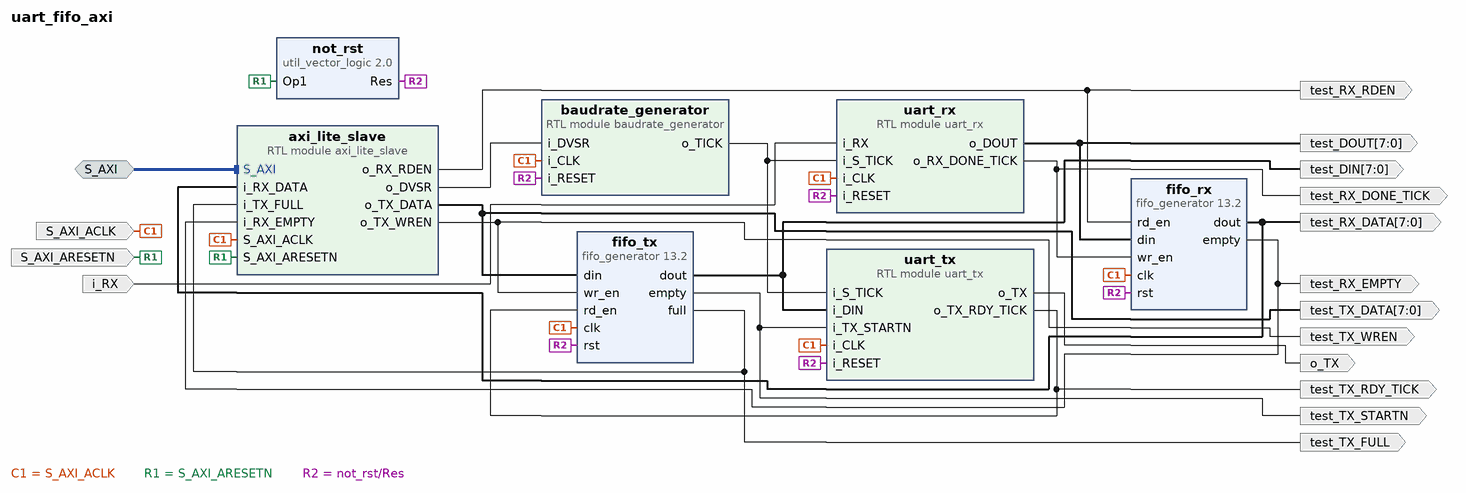
[diagram p0: block diagram of the top level]
# Vivado block design uart_fifo_axi, xc7z020clg400-1, Vivado 2023.2
create_bd_design uart_fifo_axi

create_bd_intf_port -mode Slave -vlnv xilinx.com:interface:aximm_rtl:1.0 S_AXI
set_property -dict [list \
  CONFIG.ADDR_WIDTH 16 \
  CONFIG.ARUSER_WIDTH 0 \
  CONFIG.AWUSER_WIDTH 0 \
  CONFIG.BUSER_WIDTH 0 \
  CONFIG.DATA_WIDTH 32 \
  CONFIG.HAS_BRESP 1 \
  CONFIG.HAS_BURST 0 \
  CONFIG.HAS_CACHE 0 \
  CONFIG.HAS_LOCK 0 \
  CONFIG.HAS_PROT 0 \
  CONFIG.HAS_QOS 0 \
  CONFIG.HAS_REGION 0 \
  CONFIG.HAS_RRESP 1 \
  CONFIG.HAS_WSTRB 1 \
  CONFIG.ID_WIDTH 0 \
  CONFIG.MAX_BURST_LENGTH 1 \
  CONFIG.NUM_READ_OUTSTANDING 1 \
  CONFIG.NUM_READ_THREADS 1 \
  CONFIG.NUM_WRITE_OUTSTANDING 1 \
  CONFIG.NUM_WRITE_THREADS 1 \
  CONFIG.PROTOCOL AXI4LITE \
  CONFIG.READ_WRITE_MODE READ_WRITE \
  CONFIG.RUSER_BITS_PER_BYTE 0 \
  CONFIG.RUSER_WIDTH 0 \
  CONFIG.SUPPORTS_NARROW_BURST 0 \
  CONFIG.WUSER_BITS_PER_BYTE 0 \
  CONFIG.WUSER_WIDTH 0 \
] [get_bd_intf_ports S_AXI]
create_bd_port -dir I i_RX
create_bd_port -dir O o_TX
create_bd_port -dir O -from 7 -to 0 test_DOUT
create_bd_port -dir O test_RX_DONE_TICK
create_bd_port -dir O -from 7 -to 0 test_DIN
create_bd_port -dir O test_TX_STARTN
create_bd_port -dir O test_TX_RDY_TICK
create_bd_port -dir I -type clk S_AXI_ACLK
set_property -dict {CONFIG.ASSOCIATED_BUSIF S_AXI} [get_bd_ports S_AXI_ACLK]
create_bd_port -dir I -type rst S_AXI_ARESETN
create_bd_port -dir O test_RX_EMPTY
create_bd_port -dir O -from 7 -to 0 test_RX_DATA
create_bd_port -dir O test_RX_RDEN
create_bd_port -dir O test_TX_FULL
create_bd_port -dir O -from 7 -to 0 test_TX_DATA
create_bd_port -dir O test_TX_WREN

create_bd_cell -type module -reference uart_tx uart_tx
create_bd_cell -type module -reference baudrate_generator baudrate_generator
create_bd_cell -type ip -vlnv xilinx.com:ip:fifo_generator:13.2 fifo_tx
set_property -dict {CONFIG.Fifo_Implementation Common_Clock_Builtin_FIFO CONFIG.Input_Data_Width 8} [get_bd_cells fifo_tx]
create_bd_cell -type module -reference uart_rx uart_rx
create_bd_cell -type ip -vlnv xilinx.com:ip:fifo_generator:13.2 fifo_rx
set_property -dict {CONFIG.Fifo_Implementation Common_Clock_Builtin_FIFO CONFIG.Input_Data_Width 8} [get_bd_cells fifo_rx]
create_bd_cell -type module -reference axi_lite_slave axi_lite_slave
create_bd_cell -type ip -vlnv xilinx.com:ip:util_vector_logic:2.0 not_rst
set_property -dict {CONFIG.C_OPERATION not CONFIG.C_SIZE 1} [get_bd_cells not_rst]

# ---- connections ----

connect_bd_intf_net -intf_net S_AXI_0_1 [get_bd_intf_ports S_AXI] [get_bd_intf_pins axi_lite_slave/S_AXI]
connect_bd_net -net S_AXI_ACLK_0_1 [get_bd_ports S_AXI_ACLK] \
  [get_bd_pins fifo_tx/clk] [get_bd_pins uart_rx/i_CLK] [get_bd_pins fifo_rx/clk] [get_bd_pins uart_tx/i_CLK] \
  [get_bd_pins axi_lite_slave/S_AXI_ACLK] [get_bd_pins baudrate_generator/i_CLK]
connect_bd_net -net S_AXI_ARESETN_1_1 [get_bd_ports S_AXI_ARESETN] [get_bd_pins not_rst/Op1] [get_bd_pins axi_lite_slave/S_AXI_ARESETN]
connect_bd_net -net axi_lite_slave_0_o_DVSR [get_bd_pins axi_lite_slave/o_DVSR] [get_bd_pins baudrate_generator/i_DVSR]
connect_bd_net [get_bd_pins axi_lite_slave/o_RX_RDEN] [get_bd_ports test_RX_RDEN] [get_bd_pins fifo_rx/rd_en]
connect_bd_net [get_bd_pins axi_lite_slave/o_TX_DATA] [get_bd_ports test_TX_DATA] [get_bd_pins fifo_tx/din]
connect_bd_net [get_bd_pins axi_lite_slave/o_TX_WREN] [get_bd_ports test_TX_WREN] [get_bd_pins fifo_tx/wr_en]
connect_bd_net -net baudrate_generator_0_o_TICK [get_bd_pins baudrate_generator/o_TICK] [get_bd_pins uart_rx/i_S_TICK] [get_bd_pins uart_tx/i_S_TICK]
connect_bd_net [get_bd_pins fifo_rx/dout] [get_bd_ports test_RX_DATA] [get_bd_pins axi_lite_slave/i_RX_DATA]
connect_bd_net [get_bd_pins fifo_rx/empty] [get_bd_ports test_RX_EMPTY] [get_bd_pins axi_lite_slave/i_RX_EMPTY]
connect_bd_net [get_bd_pins fifo_tx/dout] [get_bd_ports test_DIN] [get_bd_pins uart_tx/i_DIN]
connect_bd_net [get_bd_pins fifo_tx/empty] [get_bd_ports test_TX_STARTN] [get_bd_pins uart_tx/i_TX_STARTN]
connect_bd_net [get_bd_pins fifo_tx/full] [get_bd_ports test_TX_FULL] [get_bd_pins axi_lite_slave/i_TX_FULL]
connect_bd_net -net i_RX_0_1 [get_bd_ports i_RX] [get_bd_pins uart_rx/i_RX]
connect_bd_net [get_bd_pins uart_rx/o_DOUT] [get_bd_ports test_DOUT] [get_bd_pins fifo_rx/din]
connect_bd_net [get_bd_pins uart_rx/o_RX_DONE_TICK] [get_bd_ports test_RX_DONE_TICK] [get_bd_pins fifo_rx/wr_en]
connect_bd_net -net uart_tx_1_o_TX [get_bd_pins uart_tx/o_TX] [get_bd_ports o_TX]
connect_bd_net [get_bd_pins uart_tx/o_TX_RDY_TICK] [get_bd_ports test_TX_RDY_TICK] [get_bd_pins fifo_tx/rd_en]
connect_bd_net -net util_vector_logic_0_Res [get_bd_pins not_rst/Res] \
  [get_bd_pins fifo_rx/rst] [get_bd_pins fifo_tx/rst] [get_bd_pins uart_rx/i_RESET] [get_bd_pins uart_tx/i_RESET] \
  [get_bd_pins baudrate_generator/i_RESET]

# ---- address map ----
assign_bd_address -offset 0x0000 -range 4K -target_address_space [get_bd_addr_spaces S_AXI] [get_bd_addr_segs axi_lite_slave/S_AXI/reg0]

validate_bd_design
save_bd_design
